# EasyEDA schematic Controller.json
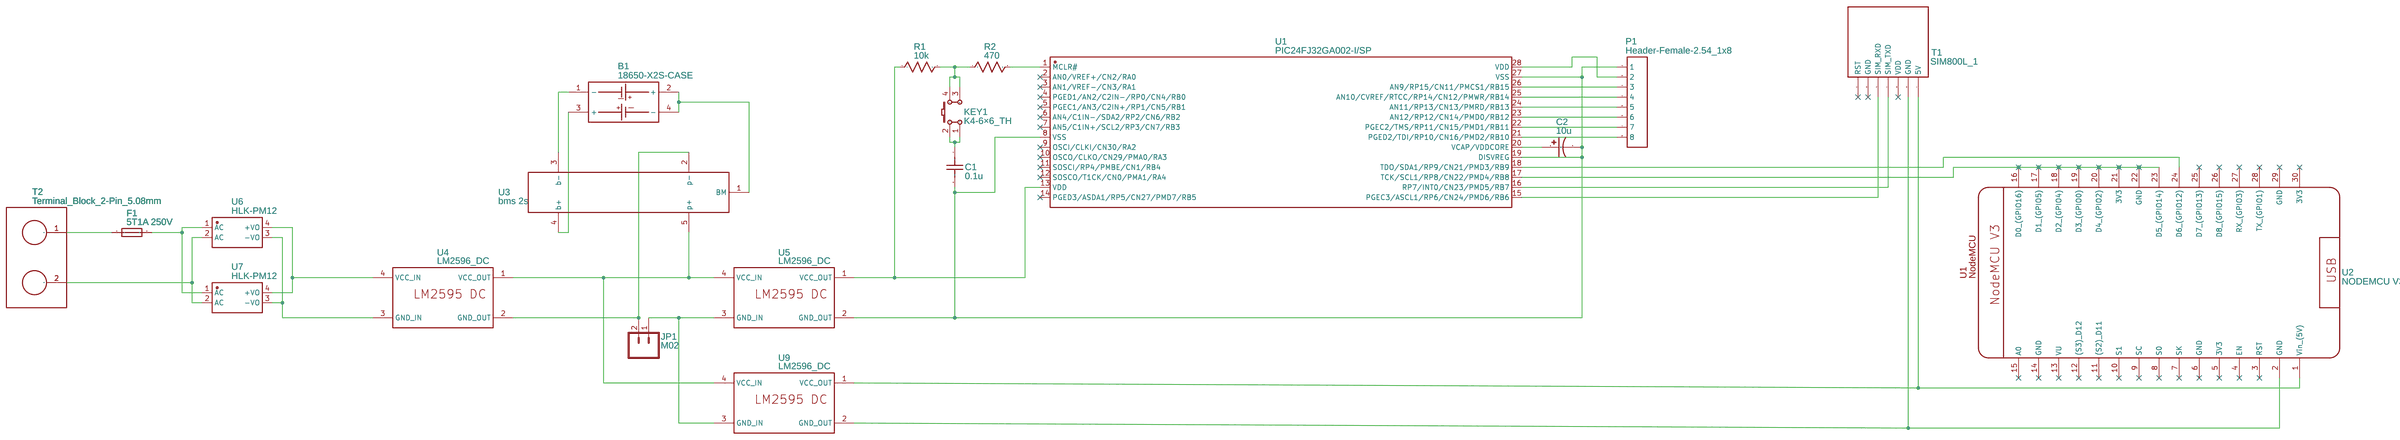
[diagram p0: schematic sheet]

## Parts
B1  18650-X2S-CASE  [18650-X2S]
C1  0.1u  [CAP-D5.0XF2.0]
C2  10u  [CAP-D5.0XF2.0]
F1  5T1A 250V  [FUSE-TH_BD5.8-L22.5-P26.50-D0.7]
JP1  M02  [SCREWTERMINAL-5MM-2]
KEY1  K4-6×6_TH  [KEY-TH_4P-L6.0-W6.0-P4.50-LS6.5]
P1  Header-Female-2.54_1x8  [HDR-TH_8P-P2.54-V-F-1]
R1  10k  [RC05]
R2  470  [RC05]
T1  SIM800L_1  [SIM800L]
T2  Terminal_Block_2-Pin_5.08mm  [TERMINAL_BLOCK_2-PIN_5.08]
U1  PIC24FJ32GA002-I/SP  [SPDIP-28_L34.7-W7.2-P2.54-LS7.9-BL]
U2  NODEMCU V3 COPY  [NODEMCU_V3]
U3  bms 2s  [BMS 2S]
U4  LM2596_DC  [LM2596_DC]
U5  LM2596_DC  [LM2596_DC]
U6  HLK-PM12  [PWRM-TH_HLK-PM12]
U7  HLK-PM12  [PWRM-TH_HLK-PM12]
U9  LM2596_DC  [LM2596_DC]

## Library data of the parts
B1 = 18650-X2S-CASE: Contributor: Александр Концевой
C1 = C_0603_US: Contributor: LCEDA_Lib
C2 = C_Tan_SMD_A_US: Contributor: LCEDA_Lib
F1 = 5T1A 250V: Supplier: LCSC; Supplier Part: C140519; Manufacturer: XC Elec(Shenzhen); Contributor: LCSC; JLCPCB Part Class: Extended Part
JP1 = M02: Contributor: SparkFun
KEY1 = K4-6×6_TH: Supplier: LCSC; Supplier Part: C136684; Manufacturer: 韩国韩荣; Manufacturer Part: K2-1102DP-E4SW-04; Contributor: LCEDA_Lib
P1 = Header-Female-2.54_1x8: Supplier: LCSC; Manufacturer: BOOMELE; Manufacturer Part: Female headerHDR1X8-2.54; Supplier Part: C27438; JLCPCB Part Class: Extended Part
R1 R2 = R_0603_US: Contributor: LCEDA_Lib
T1 = SIM800L_1: sourceId: Cf9Flf9rJ
T2 = Terminal_Block_2-Pin_5.08mm: Manufacturer: Excellway; Supplier Part: DR55-8-Pin-5.08mm; Contributor: kenschellenberg
U1 = PIC24FJ32GA002-I/SP: Supplier: LCSC; Supplier Part: C643615; Manufacturer: Microchip Tech; Contributor: LCSC; JLCPCB Part Class: Extended Part
U2 = NODEMCU V3 COPY: Contributor: anjurado
U3 = bms 2s: Contributor: Impostory
U4 U5 U9 = LM2596_DC: Manufacturer Part: LM2596 DC 5V; Contributor: anton.starshinov
U6 U7 = HLK-PM12: Supplier: LCSC; Supplier Part: C209905; Manufacturer: HI-LINK; Contributor: LCSC; JLCPCB Part Class: Extended Part

## Nets
Net-(B1-1): B1.1(-) U3.3(b-)
Net-(B1-2): B1.2(+) B1.4(-) U3.1(BM)
Net-(B1-3): B1.3(+) U3.4(b+)
Net-(C1-1): C1.1 KEY1.1 KEY1.2
Net-(C1-2): C1.2 C2.2 P1.1 U1.8(VSS) U1.19(DISVREG) U1.27(VSS) U5.2(GND_OUT)
Net-(C2-1): C2.1 U1.20(VCAP/VDDCORE)
Net-(F1-1): F1.1 T2.1
Net-(F1-2): F1.2 U6.1(AC) U7.1(AC)
Net-(JP1-1): JP1.1 U5.3(GND_IN) U9.3(GND_IN)
Net-(JP1-2): JP1.2 U3.2(p-) U4.2(GND_OUT)
Net-(KEY1-3): KEY1.3 KEY1.4 R1.2 R2.1
Net-(P1-2): P1.2 U1.28(VDD)
Net-(P1-3): P1.3 U1.26(AN9/RP15/CN11/PMCS1/RB15)
Net-(P1-4): P1.4 U1.25(AN10/CVREF/RTCC/RP14/CN12/PMWR/RB14)
Net-(P1-5): P1.5 U1.24(AN11/RP13/CN13/PMRD/RB13)
Net-(P1-6): P1.6 U1.23(AN12/RP12/CN14/PMD0/RB12)
Net-(P1-7): P1.7 U1.22(PGEC2/TMS/RP11/CN15/PMD1/RB11)
Net-(P1-8): P1.8 U1.21(PGED2/TDI/RP10/CN16/PMD2/RB10)
Net-(R1-1): R1.1 U1.13(VDD) U5.1(VCC_OUT)
Net-(R2-2): R2.2 U1.1(MCLR#)
Net-(T1-3): T1.3(SIM_RXD) U1.15(PGEC3/ASCL1/RP6/CN24/PMD6/RB6)
Net-(T1-4): T1.4(SIM_TXD) U1.16(RP7/INT0/CN23/PMD5/RB7)
Net-(T1-6): T1.6(GND) U2.2(GND) U9.2(GND_OUT)
Net-(T1-7): T1.7(5V) U2.1(Vin (5V)) U9.1(VCC_OUT)
Net-(T2-2): T2.2 U6.2(AC) U7.2(AC)
Net-(U1-17): U1.17(TCK/SCL1/RP8/CN22/PMD4/RB8) U2.16(D0 (GPIO16)) U2.17(D1 (GPIO5)) U2.18(D2 (GPIO4)) U2.19(D3 (GPIO0)) U2.20(D4 (GPIO2)) U2.21(3V3) U2.22(GND) U2.23(D5 (GPIO14))
Net-(U1-18): U1.18(TDO/SDA1/RP9/CN21/PMD3/RB9) U2.24(D6 (GPIO12))
Net-(U3-5): U3.5(p+) U4.1(VCC_OUT) U5.4(VCC_IN) U9.4(VCC_IN)
Net-(U4-3): U4.3(GND_IN) U6.3(-VO) U7.3(-VO)
Net-(U4-4): U4.4(VCC_IN) U6.4(+VO) U7.4(+VO)

Not connected (* = marked no-connect by the designer): T1 1(RST)* 2(GND)* 5(VDD)*; U1 2(AN0/VREF+/CN2/RA0)* 3(AN1/VREF-/CN3/RA1)* 4(PGED1/AN2/C2IN-/RP0/CN4/RB0)* 5(PGEC1/AN3/C2IN+/RP1/CN5/RB1)* 6(AN4/C1IN-/SDA2/RP2/CN6/RB2)* 7(AN5/C1IN+/SCL2/RP3/CN7/RB3)* 9(OSCI/CLKI/CN30/RA2)* 10(OSCO/CLKO/CN29/PMA0/RA3)* 11(SOSCI/RP4/PMBE/CN1/RB4)* 12(SOSCO/T1CK/CN0/PMA1/RA4)* 14(PGED3/ASDA1/RP5/CN27/PMD7/RB5)*; U2 3(RST)* 4(EN)* 5(3V3)* 6(GND)* 7(SK)* 8(S0)* 9(SC)* 10(S1)* 11((S2) D11)* 12((S3) D12)* 13(VU)* 14(GND)* 15(A0)* 25(D7 (GPIO13))* 26(D8 (GPIO15))* 27(RX (GPIO3))* 28(TX (GPIO1))* 29(GND)* 30(3V3)*
